# Altium schematic sheet MCU.SchDoc
size A4; SheetNumber: 3; SheetTotal: 6
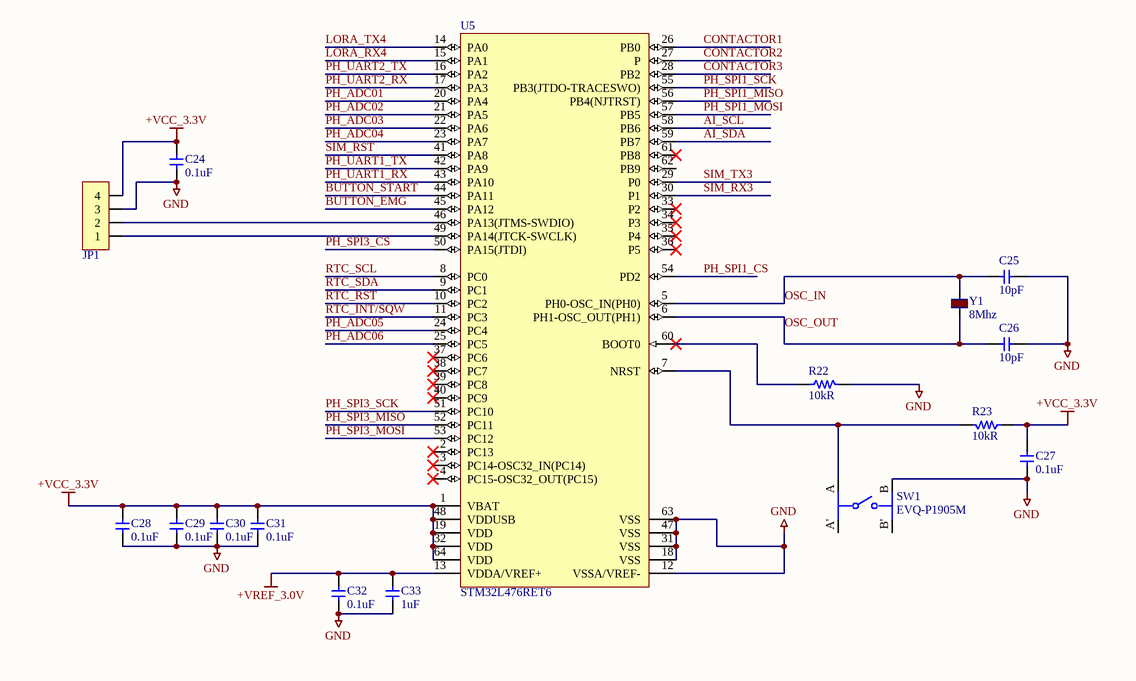
[diagram p0: MCU.SchDoc]

## Parts
C24  0.1uF  [CAP 0402 (1005)]
C25  10pF  [CAP 0402 (1005)]
C26  10pF  [CAP 0402 (1005)]
C27  0.1uF  [CAP 0402 (1005)]
C28  0.1uF  [CAP 0402 (1005)]
C29  0.1uF  [CAP 0402 (1005)]
C30  0.1uF  [CAP 0402 (1005)]
C31  0.1uF  [CAP 0402 (1005)]
C32  0.1uF  [CAP 0402 (1005)]
C33  1uF  [CAP 0402 (1005)]
JP1  JP 1x4 2.54  [JP 1X4 DT]  (value not drawn)
R22  10kR  [RES 0402 (1005)]
R23  10kR  [RES 0402 (1005)]
SW1  EVQ-P1905M  [FP-EVQ-P1905M-MFG]
U5  STM32L476RET6  [STM-LQFP64_L]
Y1  8Mhz  [SMD5032]

## Nets
+VCC_3.3V: C24.1 C27.2 C28.1 C29.1 C30.1 C31.1 JP1.4 R23.2 U5.1(VBAT) U5.19(VDD) U5.32(VDD) U5.48(VDDUSB) U5.64(VDD)
+VREF_3.0V: C32.1 C33.1 U5.13(VDDA/VREF+)
GND: C24.2 C25.1 C26.1 C27.1 C28.2 C29.2 C30.2 C31.2 C32.2 C33.2 JP1.3 R22.1 SW1.B U5.12(VSSA/VREF-) U5.18(VSS) U5.31(VSS) U5.47(VSS) U5.63(VSS)
AI_SCL: U5.58(PB6)
AI_SDA: U5.59(PB7)
BUTTON_EMG: U5.45(PA12)
BUTTON_START: U5.44(PA11)
CONTACTOR1: U5.26(PB0)
CONTACTOR2: U5.27(P)
CONTACTOR3: U5.28(PB2)
LORA_RX4: U5.15(PA1)
LORA_TX4: U5.14(PA0)
OSC_IN: C25.2 U5.5(PH0-OSC_IN(PH0)) Y1.2
OSC_OUT: C26.2 U5.6(PH1-OSC_OUT(PH1)) Y1.1
PH_ADC01: U5.20(PA4)
PH_ADC02: U5.21(PA5)
PH_ADC03: U5.22(PA6)
PH_ADC04: U5.23(PA7)
PH_ADC05: U5.24(PC4)
PH_ADC06: U5.25(PC5)
PH_SPI1_CS: U5.54(PD2)
PH_SPI1_MISO: U5.56(PB4(NJTRST))
PH_SPI1_MOSI: U5.57(PB5)
PH_SPI1_SCK: U5.55(PB3(JTDO-TRACESWO))
PH_SPI3_CS: U5.50(PA15(JTDI))
PH_SPI3_MISO: U5.52(PC11)
PH_SPI3_MOSI: U5.53(PC12)
PH_SPI3_SCK: U5.51(PC10)
PH_UART1_RX: U5.43(PA10)
PH_UART1_TX: U5.42(PA9)
PH_UART2_RX: U5.17(PA3)
PH_UART2_TX: U5.16(PA2)
RTC_INT/SQW: U5.11(PC3)
RTC_RST: U5.10(PC2)
RTC_SCL: U5.8(PC0)
RTC_SDA: U5.9(PC1)
SIM_RST: U5.41(PA8)
SIM_RX3: U5.30(P1)
SIM_TX3: U5.29(P0)
NetJP1_1: JP1.1 U5.49(PA14(JTCK-SWCLK))
NetJP1_2: JP1.2 U5.46(PA13(JTMS-SWDIO))
NetR22_2: R22.2 U5.60(BOOT0)
NetR23_1: R23.1 SW1.A U5.7(NRST)

Not connected (* = marked no-connect by the designer): SW1 A' B'; U5 2(PC13)* 3(PC14-OSC32_IN(PC14))* 4(PC15-OSC32_OUT(PC15))* 33(P2)* 34(P3)* 35(P4)* 36(P5)* 37(PC6)* 38(PC7)* 39(PC8)* 40(PC9)* 61(PB8)* 62(PB9)

## Library data of the parts
C24 C27-C32 = CAP0402 0.1uF 50V: 50V 100nF ±10% 0402 Multilayer Ceramic Capacitors MLCC - SMD/SMT ROHS; Manufacturer: Samwha Capacitor; Manufacturer Part Number: CS1005X7R104K500NR; Supplier: LCSC electronics; Unit Price: $0.0017
C25 C26 = CAP0402 10pF 50V: 50V 10pF CH ±2% 0402 Multilayer Ceramic Capacitors MLCC - SMD/SMT ROHS; Manufacturer: Murata Electronics; Manufacturer Part Number: GRM1552C1H100GA01D; Supplier: LCSC electronics; Unit Price: $0.0067
C33 = CAP0402 1uF 25V: 25V 1uF ±10% 0402 Multilayer Ceramic Capacitors MLCC - SMD/SMT ROHS; Manufacturer: FH (Guangdong Fenghua Advanced Tech); Manufacturer Part Number: 0402X105K250NT; Supplier: LCSC electronics; Unit Price: US$ 0.0044
JP1 = JP 1x4 2.54 Duc Thang: Cắm; Ten_Linh_Kien: Jump Đơn Đực 2.54MM 1x40P Thẳng 11MM; Don_Vi: Con; Ma_Hang: MH000903; Ghi_Chu: *; Kieu_Chan: *; Chung_Loai: Cắm
R22 R23 = RES0402 10kR 1%: ±1% 10kΩ 0402 Chip Resistor - Surface Mount ROHS; Manufacturer: VO; Manufacturer Part Number: SCR0402F10K; Supplier: LCSC electronics; Unit Price: $0.0005
SW1 = CMP-05618-000070-1: SWITCH TACTILE SPST-NO 0.05A 12V; Current Rating: 50mA; Operating Force: 1.6N; Illumination Type: Non-Illuminated; Actuator Length: 1.5mm; Actuator Type: Standard; Electrical Life: 100000Cycles; Contact Resistance: 100mR; Actuator Color: Natural; Throw Configuration: SPST; Switch Travel: 1.3mm; Switch Function: Off-Mom; Mount: Surface Mount; Lead Free: Lead Free; Orientation: Straight; REACH SVHC: No SVHC; Max Voltage Rating (DC): 12V; Packaging: Tape and Reel; Mechanical Life: 100000Cycles; Voltage Rating (DC): 12V; Package Quantity: 2000; Series: EVQP1; Case/Package: SMD/SMT; Max Operating Temperature: 85°C; Size: 6.1mm; Contact Plating: Gold; Termination: J-Bend; Min Operating Temperature: -40°C; Radiation Hardening: No; RoHS Compliant: Yes
U5 = CMP-1655-00011-2: Ultra-Low-Power ARM Cortex-M4 32-bit MCU+FPU, 512 KB Flash, 128 KB Internal RAM, 51 I/Os, 64-Pin LQFP, -40 to 85 degC, Tray; Manufacturer: STMicroelectronics; Internal RAM Size (kB): 128; I/Os (High Current): 51; Operating Frequency(F) (Processor speed) (MHz): 80; FLASH Size (Prog) (kB): 512; D/A Converter: 2; Supply Voltage(Vcc) min (V): 1.71; Packing: Tray; DatasheetVersion: Rev. 4; PartNumber: STM32L476RET6; ComponentLink1URL: http://www.st.com/; Package Reference: LQFP64; Package Description: 64-Pin Low-profile Quad Flat Package, Body 10 x 10 mm, Pitch 0.5 mm; Mounting Technology: Surface Mount; ComponentLink1Description: Manufacturer URL; ComponentLink2Description: Datasheet; Core: ARM Cortex-M4; ComponentLink2URL: http://www.st.com/st-web-ui/static/active/en/resource/technical/document/datasheet/DM00108832.pdf
Y1 = CRYSTAL 8MHZ: CRYSTAL 8MHZ SMD5032; Manufacture Part Number: LK_05093; Manufacture: Banlinhkien